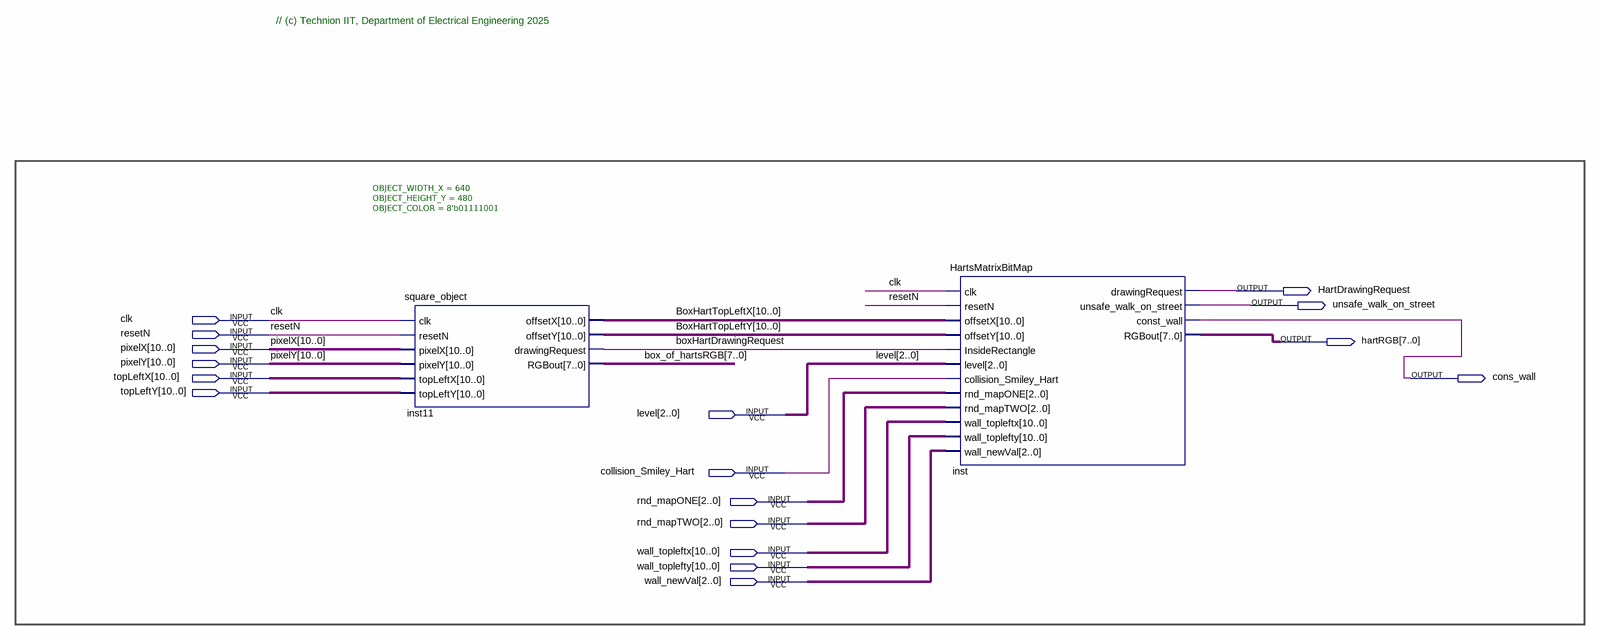
[diagram p0: schematic sheet]
// Quartus schematic HART_DISPLAY.bdf as structural Verilog: 2 symbols, 17 pins
module HART_DISPLAY (
  input  clk,
  input  resetN,
  input  [10:0] pixelX,
  input  [10:0] pixelY,
  input  [10:0] topLeftX,
  input  [10:0] topLeftY,
  input  [2:0] level,
  input  collision_Smiley_Hart,
  input  [2:0] rnd_mapONE,
  input  [2:0] rnd_mapTWO,
  input  [10:0] wall_topleftx,
  input  [10:0] wall_toplefty,
  input  [2:0] wall_newVal,
  output HartDrawingRequest,
  output unsafe_walk_on_street,
  output [7:0] hartRGB,
  output cons_wall
);

  wire boxHartDrawingRequest;
  wire [7:0] box_of_hartsRGB;
  wire [10:0] BoxHartTopLeftX, BoxHartTopLeftY;

  square_object #(.OBJECT_WIDTH_X(640), .OBJECT_HEIGHT_Y(480), .OBJECT_COLOR(8'b01111001)) inst11 (
    .clk(clk), .resetN(resetN), .pixelX(pixelX), .pixelY(pixelY), .topLeftX(topLeftX), .topLeftY(topLeftY),
    .offsetX(BoxHartTopLeftX), .offsetY(BoxHartTopLeftY), .drawingRequest(boxHartDrawingRequest),
    .RGBout(box_of_hartsRGB));
  HartsMatrixBitMap inst (
    .clk(clk), .resetN(resetN), .offsetX(BoxHartTopLeftX), .offsetY(BoxHartTopLeftY),
    .InsideRectangle(boxHartDrawingRequest), .level(level), .collision_Smiley_Hart(collision_Smiley_Hart),
    .rnd_mapONE(rnd_mapONE), .rnd_mapTWO(rnd_mapTWO), .wall_topleftx(wall_topleftx),
    .wall_toplefty(wall_toplefty), .wall_newVal(wall_newVal), .drawingRequest(HartDrawingRequest),
    .unsafe_walk_on_street(unsafe_walk_on_street), .const_wall(cons_wall), .RGBout(hartRGB));

  // Notes on the sheet:
  //   // (c) Technion IIT, Department of Electrical Engineering 2025
endmodule
